# EAGLE schematic 1-voice(3_3) (EAGLE 9.3.2)

## Sheet 1 of 3: Digital and power regulation
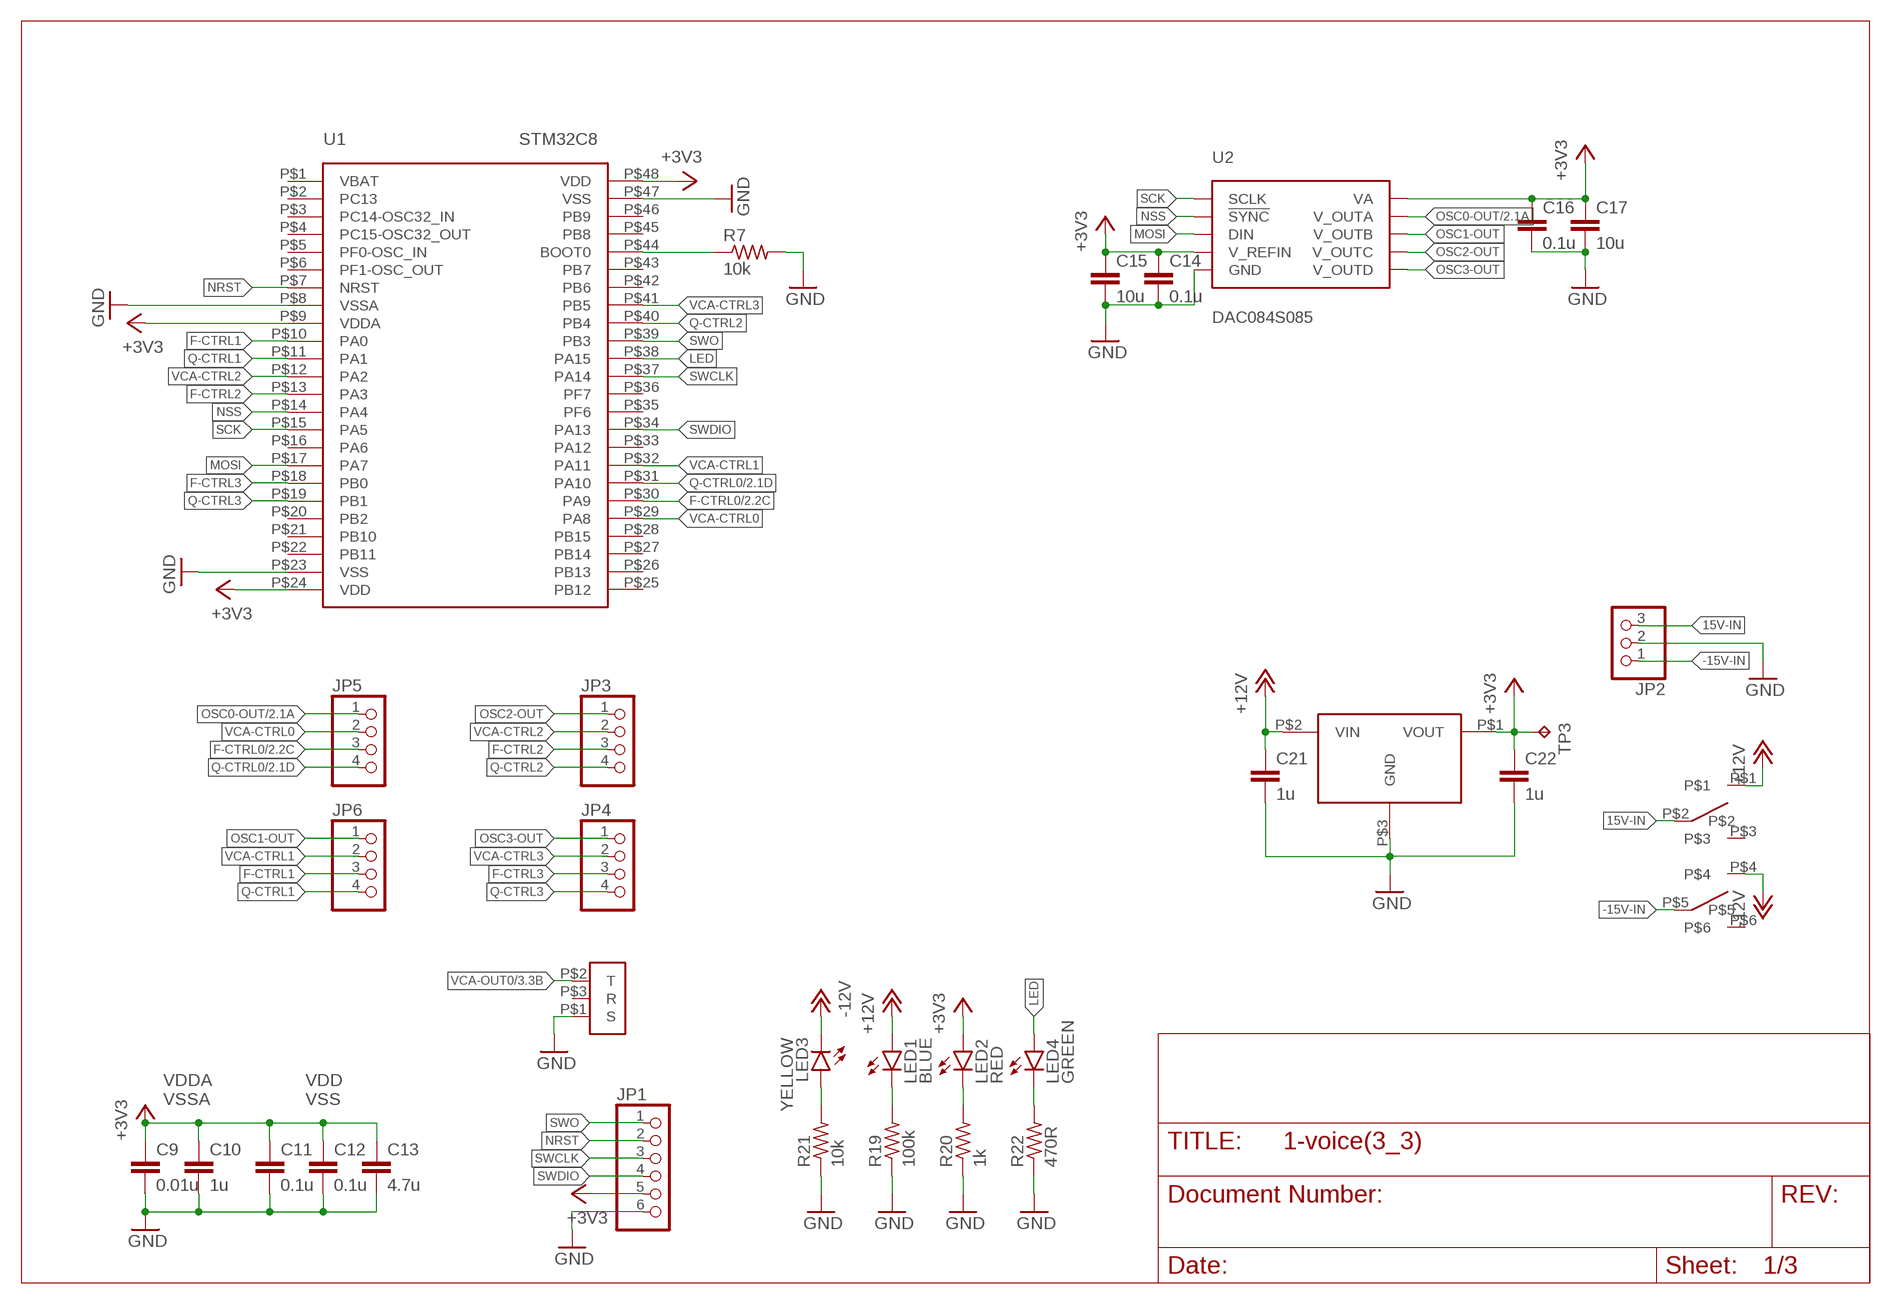
[diagram p0: schematic, sheet 1]

### Parts
C9  0.01u  C-EUC0603  [C0603]
C10  1u  C-EUC0603  [C0603]
C11  0.1u  C-EUC0603  [C0603]
C12  0.1u  C-EUC0603  [C0603]
C13  4.7u  C-EUC0603  [C0603]
C14  0.1u  C-EUC0603  [C0603]
C15  10u  C-EUC0603  [C0603]
C16  0.1u  C-EUC0603  [C0603]
C17  10u  C-EUC0603  [C0603]
C21  1u  C-EUC0603  [C0603]
C22  1u  C-EUC0603  [C0603]
JP1  PINHD-1X6  [1X06]
JP2  PINHD-1X3  [1X03]
JP3  PINHD-1X4  [1X04]
JP4  PINHD-1X4  [1X04]
JP5  PINHD-1X4  [1X04]
JP6  PINHD-1X4  [1X04]
JP7  TRS  [TRS]
LED1  BLUE  LEDSMT1206  [1206]
LED2  RED  LEDSMT1206  [1206]
LED3  YELLOW  LEDSMT1206  [1206]
LED4  GREEN  LEDSMT1206  [1206]
R7  10k  R-US_R0603  [R0603]
R19  100k  R-US_R0603  [R0603]
R20  1k  R-US_R0603  [R0603]
R21  10k  R-US_R0603  [R0603]
R22  470R  R-US_R0603  [R0603]
SW1  SWITCH-DPDT  [DPDT]
TP3  TPPAD1-13  [P1-13]
U1  STM32C8  [LQFP48]
U2  DAC084S085  [VSSOP10]
U3  TLV760  [SOT23-3]

### Nets
15V-IN: JP2.3 SW1.P$2
+3V3: C9.1 C10.1 C11.1 C12.1 C13.1 C14.1 C15.1 C16.1 C17.1 C22.1 JP1.5 LED2.A TP3.TP U1.P$9(VDDA) U1.P$24(VDD) U1.P$48(VDD) U2.P$1(VA) U2.P$7(V_REFIN) U3.P$1(VOUT)
+12V: C21.1 LED1.A SW1.P$1 U3.P$2(VIN) ; also sheet 2,3
-12V: LED3.C SW1.P$4 ; also sheet 2,3
-15V-IN: JP2.1 SW1.P$5
F-CTRL0: JP5.3 U1.P$30(PA9) ; also sheet 2,3
F-CTRL1: JP6.3 U1.P$10(PA0)
F-CTRL2: JP3.3 U1.P$13(PA3)
F-CTRL3: JP4.3 U1.P$18(PB0)
GND: C9.2 C10.2 C11.2 C12.2 C13.2 C14.2 C15.2 C16.2 C17.2 C21.2 C22.2 JP1.6 JP2.2 JP7.P$1(S) R7.2 R19.1 R20.1 R21.1 R22.1 U1.P$8(VSSA) U1.P$23(VSS) U1.P$47(VSS) U2.P$6(GND) U3.P$3(GND) ; also sheet 2,3
LED: LED4.A U1.P$38(PA15)
MOSI: U1.P$17(PA7) U2.P$8(DIN)
N$8: R7.1 U1.P$44(BOOT0)
N$17: LED1.C R19.2
N$18: LED2.C R20.2
N$21: LED3.A R21.2
N$22: LED4.C R22.2
NRST: JP1.2 U1.P$7(NRST)
NSS: U1.P$14(PA4) U2.P$9(!SYNC)
OSC0-OUT: JP5.1 U2.P$2(V_OUTA) ; also sheet 2
OSC1-OUT: JP6.1 U2.P$3(V_OUTB)
OSC2-OUT: JP3.1 U2.P$4(V_OUTC)
OSC3-OUT: JP4.1 U2.P$5(V_OUTD)
Q-CTRL0: JP5.4 U1.P$31(PA10) ; also sheet 2
Q-CTRL1: JP6.4 U1.P$11(PA1)
Q-CTRL2: JP3.4 U1.P$40(PB4)
Q-CTRL3: JP4.4 U1.P$19(PB1)
SCK: U1.P$15(PA5) U2.P$10(SCLK)
SWCLK: JP1.3 U1.P$37(PA14)
SWDIO: JP1.4 U1.P$34(PA13)
SWO: JP1.1 U1.P$39(PB3)
VCA-CTRL0: JP5.2 U1.P$29(PA8)
VCA-CTRL1: JP6.2 U1.P$32(PA11)
VCA-CTRL2: JP3.2 U1.P$12(PA2)
VCA-CTRL3: JP4.2 U1.P$41(PB5)
VCA-OUT0: JP7.P$2(T) ; also sheet 3
Unconnected: JP7.P$3(R) SW1.P$3 SW1.P$6 U1.P$1(VBAT) U1.P$2(PC13) U1.P$3(PC14-OSC32_IN) U1.P$4(PC15-OSC32_OUT) U1.P$5(PF0-OSC_IN) U1.P$6(PF1-OSC_OUT) U1.P$16(PA6) U1.P$20(PB2) U1.P$21(PB10) U1.P$22(PB11) U1.P$25(PB12) U1.P$26(PB13) U1.P$27(PB14) U1.P$28(PB15) U1.P$33(PA12) U1.P$35(PF6) U1.P$36(PF7) U1.P$42(PB6) U1.P$43(PB7) U1.P$45(PB8) U1.P$46(PB9)

### Notes on the sheet
- VDDA
  VSSA
- VDD
  VSS

## Sheet 2 of 3: Voltage-controlled low-pass filter
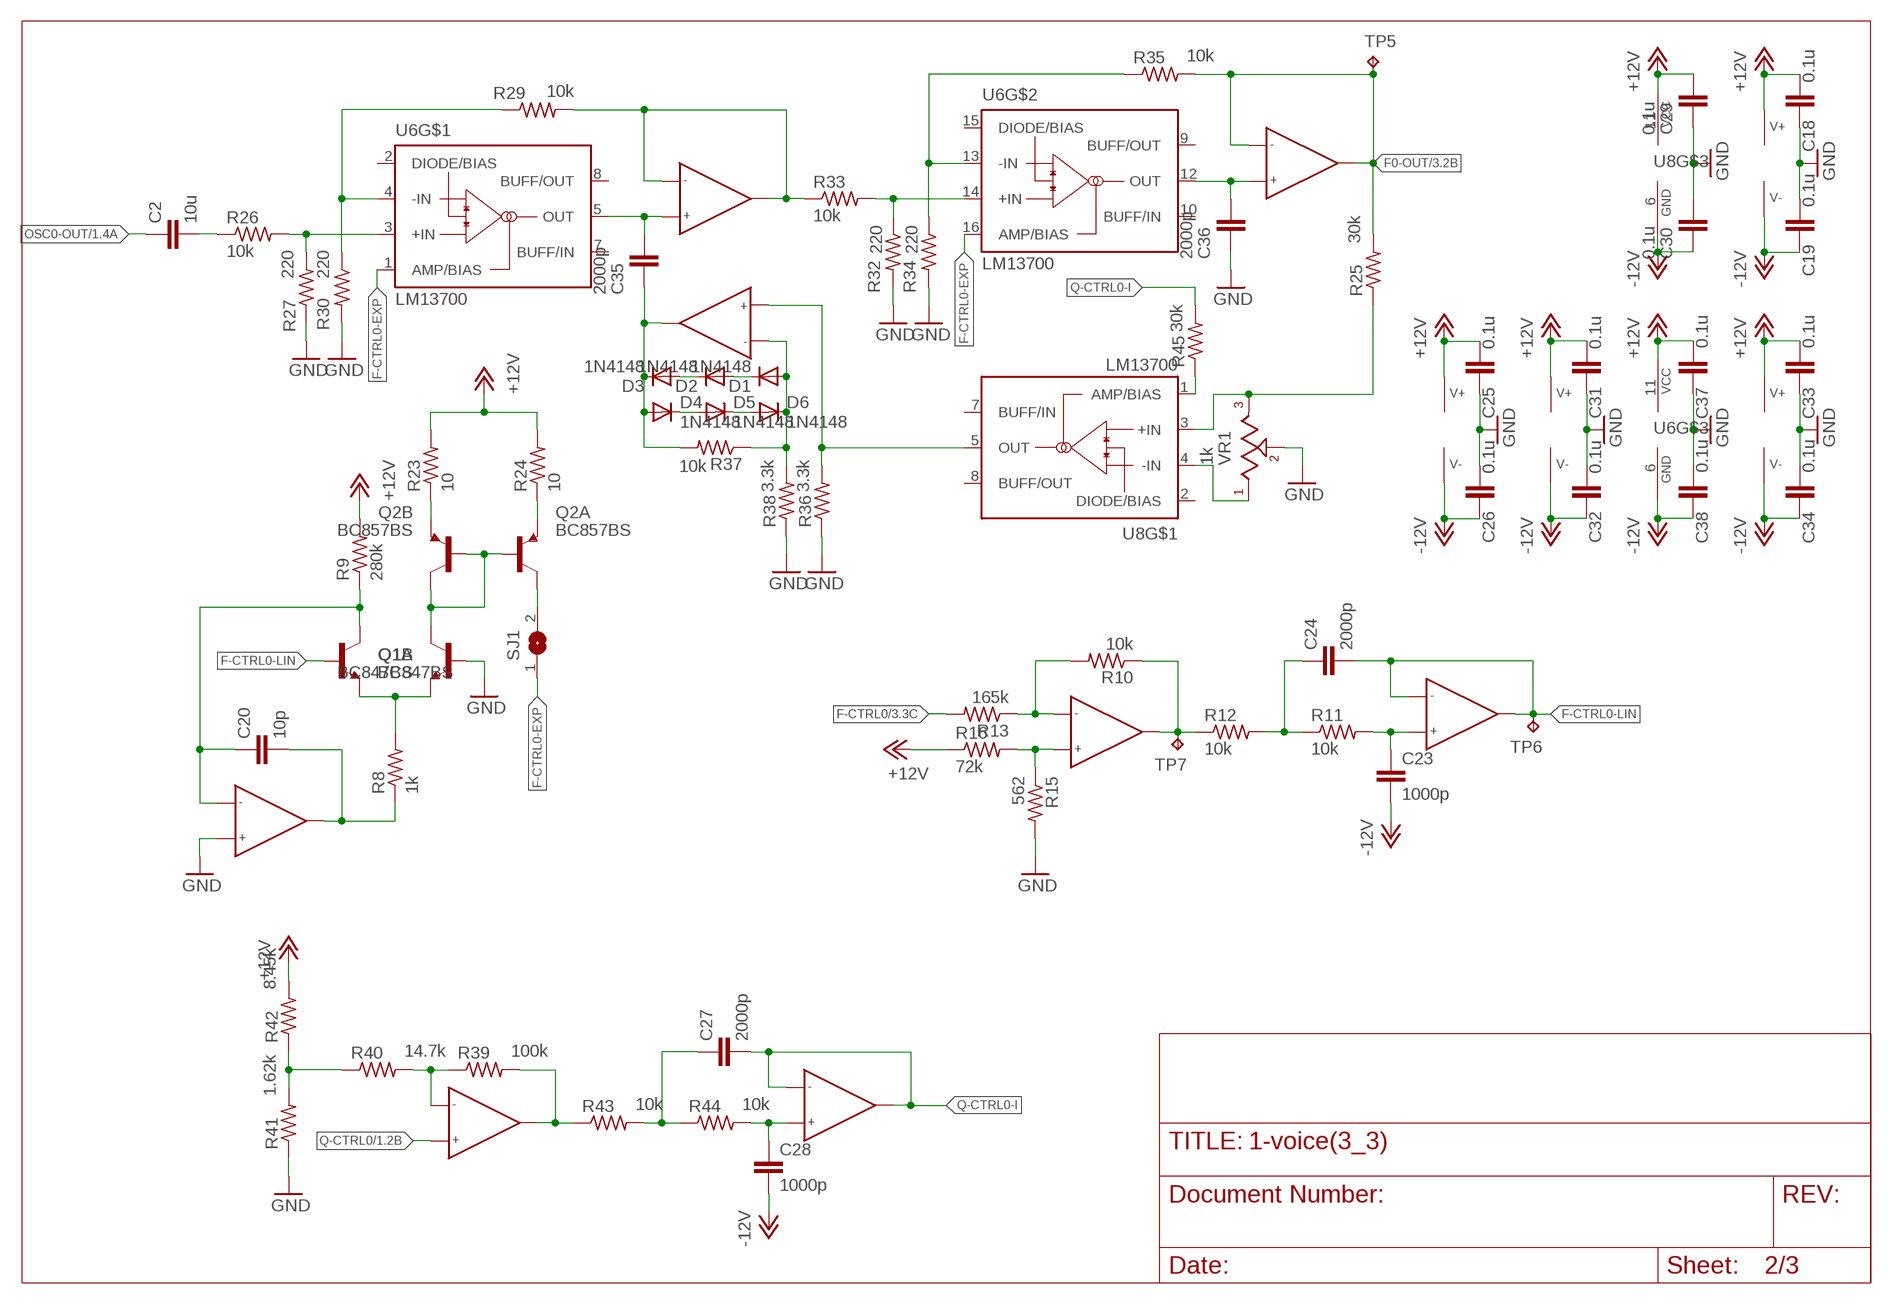
[diagram p1: schematic, sheet 2]

### Parts
C2  10u  C-EUC0603  [C0603]
C18  0.1u  C-EUC0603  [C0603]
C19  0.1u  C-EUC0603  [C0603]
C20  10p  C-EUC0603  [C0603]
C23  1000p  C-EUC0603  [C0603]
C24  2000p  C-EUC0603  [C0603]
C25  0.1u  C-EUC0603  [C0603]
C26  0.1u  C-EUC0603  [C0603]
C27  2000p  C-EUC0603  [C0603]
C28  1000p  C-EUC0603  [C0603]
C29  0.1u  C-EUC0603  [C0603]
C30  0.1u  C-EUC0603  [C0603]
C31  0.1u  C-EUC0603  [C0603]
C32  0.1u  C-EUC0603  [C0603]
C33  0.1u  C-EUC0603  [C0603]
C34  0.1u  C-EUC0603  [C0603]
C35  2000p  C-EUC0603  [C0603]
C36  2000p  C-EUC0603  [C0603]
C37  0.1u  C-EUC0603  [C0603]
C38  0.1u  C-EUC0603  [C0603]
D1  1N4148  DIODESOD123  [SOD123]
D2  1N4148  DIODESOD123  [SOD123]
D3  1N4148  DIODESOD123  [SOD123]
D4  1N4148  DIODESOD123  [SOD123]
D5  1N4148  DIODESOD123  [SOD123]
D6  1N4148  DIODESOD123  [SOD123]
Q1  BC847BS  TRANS-BJT_NPN-DUAL-BC847BS-JBLMASK  [SOT-363-JBLMASK]
Q2  BC857BS  TRANS-BJT_PNP-DUAL-BC857-JBLMASK  [SOT-363-JBLMASK]
R8  1k  R-US_R0603  [R0603]
R9  280k  R-US_R0603  [R0603]
R10  10k  R-US_R0603  [R0603]
R11  10k  R-US_R0603  [R0603]
R12  10k  R-US_R0603  [R0603]
R13  165k  R-US_R0603  [R0603]
R15  562  R-US_R0603  [R0603]
R16  72k  R-US_R0603  [R0603]
R23  10  R-US_R0603  [R0603]
R24  10  R-US_R0603  [R0603]
R25  30k  R-US_R0603  [R0603]
R26  10k  R-US_R0603  [R0603]
R27  220  R-US_R0603  [R0603]
R29  10k  R-US_R0603  [R0603]
R30  220  R-US_R0603  [R0603]
R32  220  R-US_R0603  [R0603]
R33  10k  R-US_R0603  [R0603]
R34  220  R-US_R0603  [R0603]
R35  10k  R-US_R0603  [R0603]
R36  3.3k  R-US_R0603  [R0603]
R37  10k  R-US_R0603  [R0603]
R38  3.3k  R-US_R0603  [R0603]
R39  100k  R-US_R0603  [R0603]
R40  14.7k  R-US_R0603  [R0603]
R41  1.62k  R-US_R0603  [R0603]
R42  8.45k  R-US_R0603  [R0603]
R43  10k  R-US_R0603  [R0603]
R44  10k  R-US_R0603  [R0603]
R45  30k  R-US_R0603  [R0603]
SJ1  SJ  [SJ]
TP5  TPPAD1-13  [P1-13]
TP6  TPPAD1-13  [P1-13]
TP7  TPPAD1-13  [P1-13]
U4  TL072  [SOIC8]
U5  TL072  [SOIC8]
U6  LM13700  XX-13700DMP16  [DMP16]
U7  TL072  [SOIC8]
U8  LM13700  XX-13700DMP16  [DMP16]
U9  TL072  [SOIC8]
VR1  1k  POT-TRIM-SMD-BOURNS-3314J-1  [POT-TRIM-SMD-BOURNS-3314]

### Nets
+12V: C18.2 C25.2 C29.1 C31.2 C33.1 C37.1 R9.2 R16.1 R23.2 R24.2 R42.2 U4.P$8(V+) U5.P$8(V+) U6.11(VCC) U7.P$8(V+) U8.11(VCC) U9.P$8(V+) ; also sheet 1,3
-12V: C19.1 C23.2 C26.1 C28.2 C30.2 C32.1 C34.2 C38.2 U4.P$4(V-) U5.P$4(V-) U6.6(GND) U7.P$4(V-) U8.6(GND) U9.P$4(V-) ; also sheet 1,3
F0-OUT: R25.2 R35.2 TP5.TP U7.P$6(IN-) U7.P$7(OUT) ; also sheet 3
F-CTRL0: R13.2 ; also sheet 1,3
F-CTRL0-EXP: SJ1.1 U6.1(AMP/BIAS) U6.16(AMP/BIAS)
F-CTRL0-LIN: C24.2 Q1.2(A:B) TP6.TP U4.P$1(OUT) U4.P$2(IN-)
FILT_IN: C2.2 R26.1
GND: C18.1 C19.2 C25.1 C26.2 C29.2 C30.1 C31.1 C32.2 C33.2 C34.1 C36.2 C37.2 C38.1 Q1.5(B:B) R15.2 R27.1 R30.2 R32.2 R34.2 R36.1 R38.1 R41.1 U9.P$3(IN+) VR1.2 ; also sheet 1,3
N$1: R10.2 R13.1 U4.P$6(IN-)
N$7: Q2.6(A:C) SJ1.2
N$9: Q1.1(A:E) Q1.4(B:E) R8.2
N$10: C20.2 R8.1 U9.P$1(OUT)
N$11: C20.1 Q1.6(A:C) R9.1 U9.P$2(IN-)
N$12: C23.1 R11.2 U4.P$3(IN+)
N$13: Q1.3(B:C) Q2.2(A:B) Q2.3(B:C) Q2.5(B:B)
N$14: C24.1 R11.1 R12.2
N$15: R10.1 R12.1 TP7.TP U4.P$7(OUT)
N$20: R15.1 R16.2 U4.P$5(IN+)
N$23: Q2.4(B:E) R23.1
N$24: Q2.1(A:E) R24.1
N$25: C36.1 U6.12(OUT) U7.P$5(IN+)
N$26: R36.2 U8.5(OUT) U9.P$5(IN+)
N$27: R26.2 R27.2 U6.3(+IN)
N$28: C35.1 U6.5(OUT) U7.P$3(IN+)
N$29: R25.1 U8.3(+IN) VR1.1
N$30: U8.4(-IN) VR1.3
N$31: R29.1 R30.1 U6.4(-IN)
N$32: D1.A D6.C R37.1 R38.2 U9.P$6(IN-)
N$34: C35.2 D3.C D4.A R37.2 U9.P$7(OUT)
N$35: R32.1 R33.2 U6.14(+IN)
N$36: R34.1 R35.1 U6.13(-IN)
N$37: D2.C D3.A
N$38: D1.C D2.A
N$39: D4.C D5.A
N$40: D5.C D6.A
N$41: R40.1 R41.2 R42.1
N$42: R39.1 R40.2 U5.P$2(IN-)
N$43: R39.2 R43.1 U5.P$1(OUT)
N$44: C27.1 R43.2 R44.1
N$45: C28.1 R44.2 U5.P$5(IN+)
N$46: R45.1 U8.1(AMP/BIAS)
N$49: R29.2 R33.1 U7.P$1(OUT) U7.P$2(IN-)
OSC0-OUT: C2.1 ; also sheet 1
Q-CTRL0: U5.P$3(IN+) ; also sheet 1
Q-CTRL0-I: C27.2 R45.2 U5.P$6(IN-) U5.P$7(OUT)
Unconnected: U6.2(DIODE/BIAS) U6.7(BUFF/IN) U6.8(BUFF/OUT) U6.9(BUFF/OUT) U6.10(BUFF/IN) U6.15(DIODE/BIAS) U8.2(DIODE/BIAS) U8.7(BUFF/IN) U8.8(BUFF/OUT)

## Sheet 3 of 3: Voltage-controlled amplifier
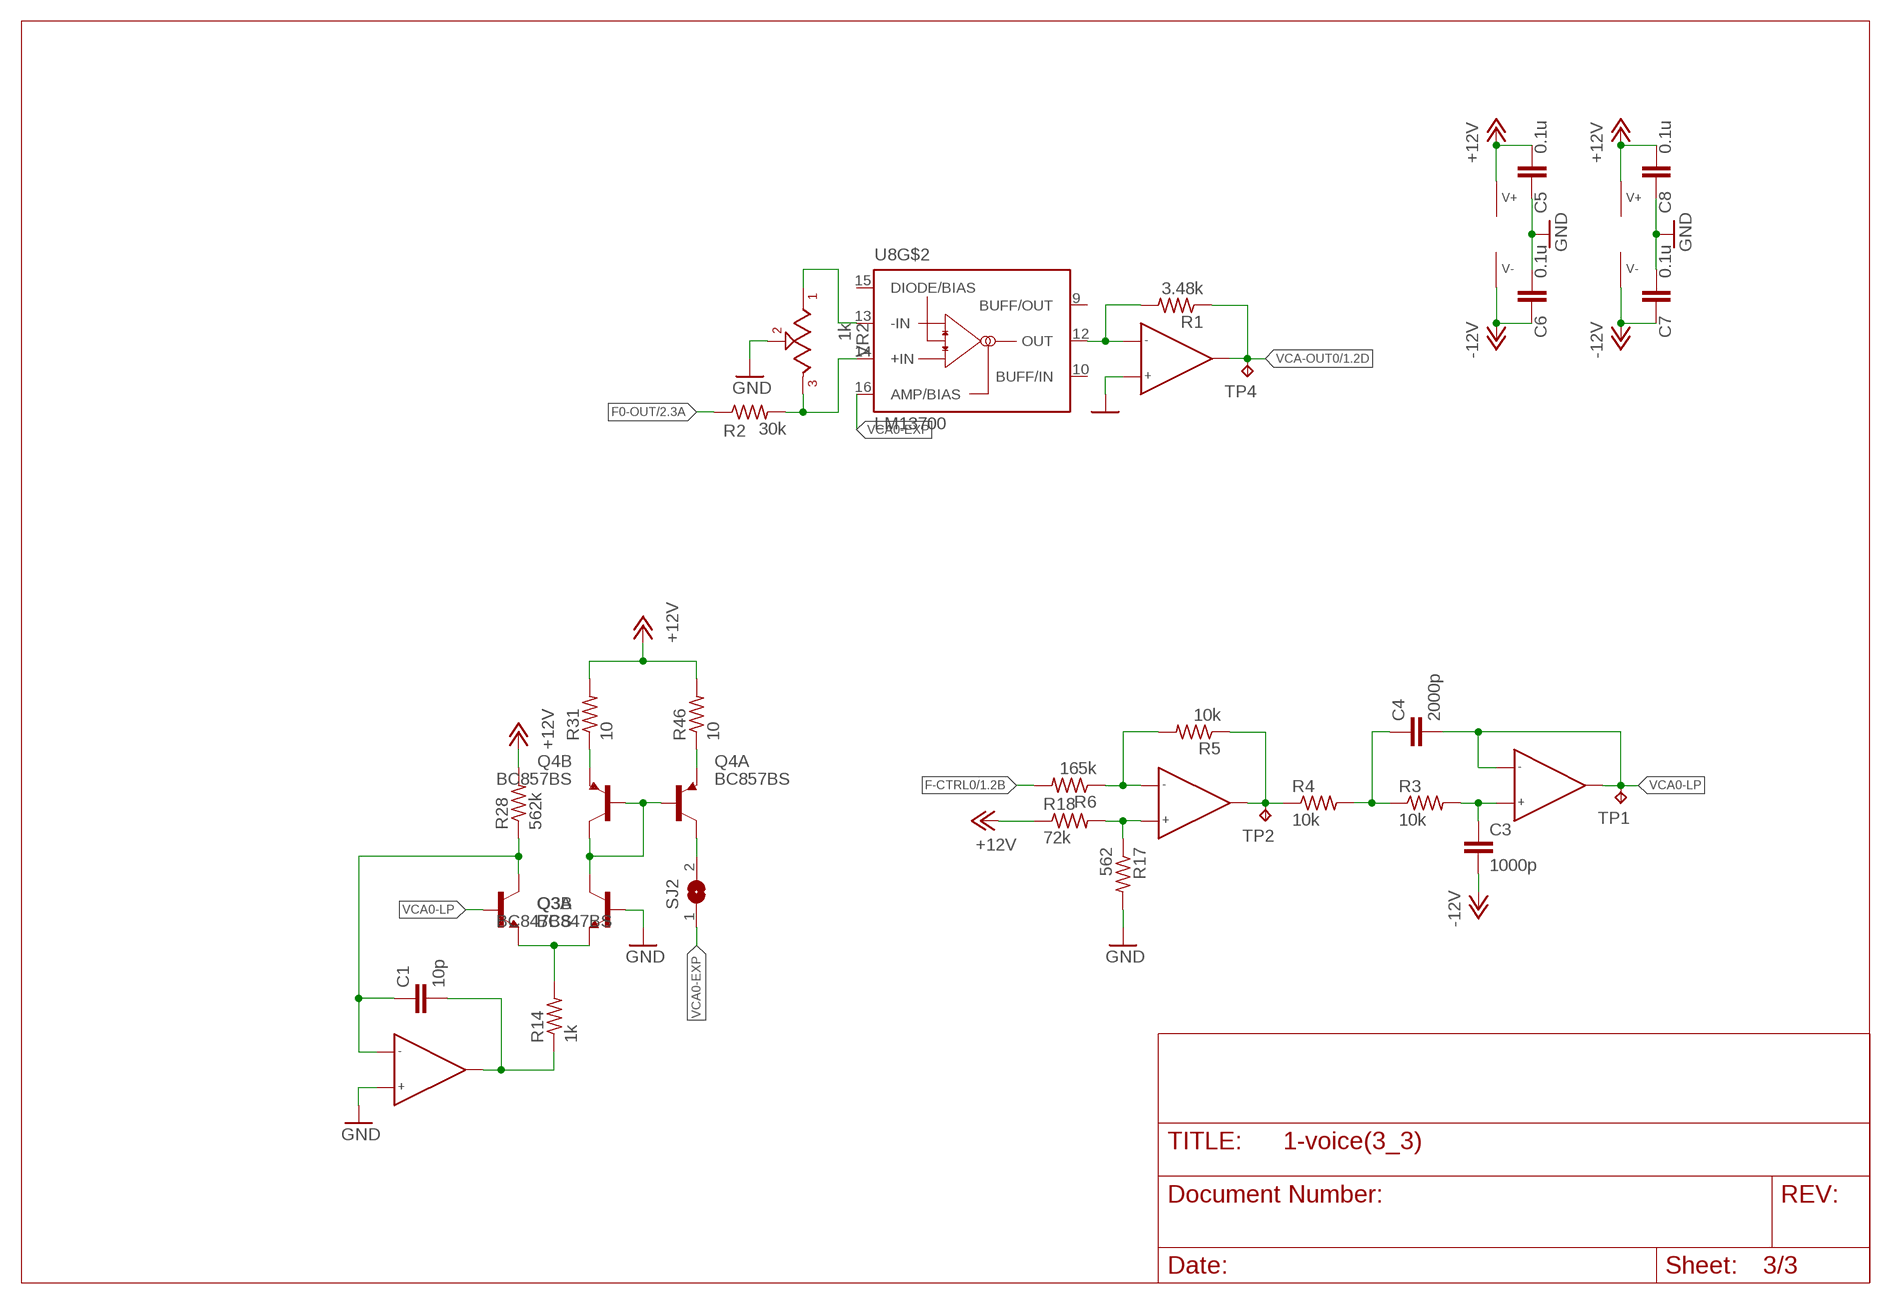
[diagram p2: schematic, sheet 3]

### Parts
C1  10p  C-EUC0603  [C0603]
C3  1000p  C-EUC0603  [C0603]
C4  2000p  C-EUC0603  [C0603]
C5  0.1u  C-EUC0603  [C0603]
C6  0.1u  C-EUC0603  [C0603]
C7  0.1u  C-EUC0603  [C0603]
C8  0.1u  C-EUC0603  [C0603]
Q3  BC847BS  TRANS-BJT_NPN-DUAL-BC847BS-JBLMASK  [SOT-363-JBLMASK]
Q4  BC857BS  TRANS-BJT_PNP-DUAL-BC857-JBLMASK  [SOT-363-JBLMASK]
R1  3.48k  R-US_R0603  [R0603]
R2  30k  R-US_R0603  [R0603]
R3  10k  R-US_R0603  [R0603]
R4  10k  R-US_R0603  [R0603]
R5  10k  R-US_R0603  [R0603]
R6  165k  R-US_R0603  [R0603]
R14  1k  R-US_R0603  [R0603]
R17  562  R-US_R0603  [R0603]
R18  72k  R-US_R0603  [R0603]
R28  562k  R-US_R0603  [R0603]
R31  10  R-US_R0603  [R0603]
R46  10  R-US_R0603  [R0603]
SJ2  SJ  [SJ]
TP1  TPPAD1-13  [P1-13]
TP2  TPPAD1-13  [P1-13]
TP4  TPPAD1-13  [P1-13]
U10  TL072  [SOIC8]
U11  TL072  [SOIC8]
VR2  1k  POT-TRIM-SMD-BOURNS-3314J-1  [POT-TRIM-SMD-BOURNS-3314]

### Nets
+12V: C5.2 C8.2 R18.1 R28.2 R31.2 R46.2 U10.P$8(V+) U11.P$8(V+) ; also sheet 1,2
-12V: C3.2 C6.1 C7.1 U10.P$4(V-) U11.P$4(V-) ; also sheet 1,2
F0-OUT: R2.1 ; also sheet 2
F-CTRL0: R6.2 ; also sheet 1,2
GND: C5.1 C6.2 C7.2 C8.1 Q3.5(B:B) R17.2 U11.P$3(IN+) U11.P$5(IN+) VR2.2 ; also sheet 1,2
N$2: R1.2 U8.12(OUT) U11.P$2(IN-)
N$3: R2.2 U8.14(+IN) VR2.1
N$4: C3.1 R3.2 U10.P$3(IN+)
N$5: C4.1 R3.1 R4.2
N$6: R4.1 R5.1 TP2.TP U10.P$7(OUT)
N$16: Q3.1(A:E) Q3.4(B:E) R14.2
N$19: R5.2 R6.1 U10.P$6(IN-)
N$33: C1.2 R14.1 U11.P$7(OUT)
N$47: U8.13(-IN) VR2.3
N$48: C1.1 Q3.6(A:C) R28.1 U11.P$6(IN-)
N$50: R17.1 R18.2 U10.P$5(IN+)
N$51: Q3.3(B:C) Q4.2(A:B) Q4.3(B:C) Q4.5(B:B)
N$52: Q4.6(A:C) SJ2.2
N$53: Q4.4(B:E) R31.1
N$54: Q4.1(A:E) R46.1
VCA0-EXP: SJ2.1 U8.16(AMP/BIAS)
VCA0-LP: C4.2 Q3.2(A:B) TP1.TP U10.P$1(OUT) U10.P$2(IN-)
VCA-OUT0: R1.1 TP4.TP U11.P$1(OUT) ; also sheet 1
Unconnected: U8.9(BUFF/OUT) U8.10(BUFF/IN) U8.15(DIODE/BIAS)

## Library data of the parts
C1-C38 = rcl:C-EU: CAPACITOR, European symbol; SPICEPREFIX: C
D1-D6 = LITTLEBITS:DIODE: Diode These are standard reverse protection diodes and small signal diodes. SMA package can handle up to about 1A. SOD-323 can handle about 200mA. What the SOD-323 package when ordering, there are some mfgs out there that are 5-pin packages.
JP1 = pinhead:PINHD-1X6: PIN HEADER
JP2 = pinhead:PINHD-1X3: PIN HEADER
JP3-JP6 = pinhead:PINHD-1X4: PIN HEADER
JP7 = synth:TRS
LED1-LED4 = led:LED: LED OSRAM: - CHIPLED LG R971, LG N971, LY N971, LG Q971, LY Q971, LO R971, LY R971 LH N974, LH R974 LS Q976, LO Q976, LY Q976 LO Q996 - Hyper CHIPLED LW Q18S LB Q993, LB Q99A, LB R99A - SideLED LS A670, LO A670, LY A670, LG A670, LP A670 LB A673, LV A673, LT A673, LW A673 LH A674 LY A675 LS A676, LA A676, LO A676, LY A676, LW A676 LS A679, LY A679, LG A679 - Hyper Micro SIDELED® LS Y876, LA Y876, LO Y876, LY Y876 LT Y87S - SmartLED LW L88C, LW L88S LB L89C, LB L89S, LG L890 LS L89K, LO L89K, LY L89K LS L896, LA L896, LO L896, LY L896 - TOPLED LS T670, LO T670, LY T670, LG T670, LP T670 LSG T670, LSP T670, LSY T670, LOP T670, LYG T670 LG T671, LOG T671, LSG T671 LB T673, LV T673, LT T673, LW T673 LH T674 LS T676, LA T676, LO T676, LY T676, LB T676, LH T676, LSB T676, LW T676 LB T67C, LV T67C, LT T67C, LS T67K, LO T67K, LY T67K, LW E67C LS E67B, LA E67B, LO E67B, LY E67B, LB E67C, LV E67C, LT E67C LW T67C LS T679, LY T679, LG T679 LS T770, LO T770, LY T770, LG T770, LP T770 LB T773, LV T773, LT T773, LW T773 LH T774 LS E675, LA E675, LY E675, LS T675 LS T776, LA T776, LO T776, LY T776, LB T776 LHGB T686 LT T68C, LB T68C - Hyper Mini TOPLED® LB M676 - Mini TOPLED Santana® LG M470 LS M47K, LO M47K, LY M47K Source: http://www.osram.convergy.de LUXEON: - LUMILED® LXK2-PW12-R00, LXK2-PW12-S00, LXK2-PW14-U00, LXK2-PW14-V00 LXK2-PM12-R00, LXK2-PM12-S00, LXK2-PM14-U00 LXK2-PE12-Q00, LXK2-PE12-R00, LXK2-PE12-S00, LXK2-PE14-T00, LXK2-PE14-U00 LXK2-PB12-K00, LXK2-PB12-L00, LXK2-PB12-M00, LXK2-PB14-N00, LXK2-PB14-P00, LXK2-PB14-Q00 LXK2-PR12-L00, LXK2-PR12-M00, LXK2-PR14-Q00, LXK2-PR14-R00 LXK2-PD12-Q00, LXK2-PD12-R00, LXK2-PD12-S00 LXK2-PH12-R00, LXK2-PH12-S00 LXK2-PL12-P00, LXK2-PL12-Q00, LXK2-PL12-R00 Source: www.luxeon.com KINGBRIGHT: KA-3528ASYC Source: www.kingbright.com
Q1 Q3 = LITTLEBITS:TRANS-BJT_NPN-DUAL; SPICEPREFIX: Q
Q2 Q4 = LITTLEBITS:TRANS-BJT_PNP-DUAL; SPICEPREFIX: Q
R1-R46 = rcl:R-US_: RESISTOR, American symbol; SPICEPREFIX: R
SJ1 SJ2 = jumper:SJ: SMD solder JUMPER; SPICEPREFIX: B
SW1 = synth:SWITCH-DPDT
TP1-TP7 = testpad:TP: Test pad
U1 = synth:STM32C8
U2 = synth:DAC084S085
U3 = synth:TLV760
U4 U5 U7 U10 U11 = synth:TL072
U6 U8 = LITTLEBITS:XX-13700
U9 = synth:TL072; SPICEPREFIX: U
VR1 VR2 = LITTLEBITS:POT-TRIM-SMD-BOURNS-3314: Bourns 3314 - 4mm Square Trimming Potentiometer